# Altium project CC3501_StabilityController.PrjPcb
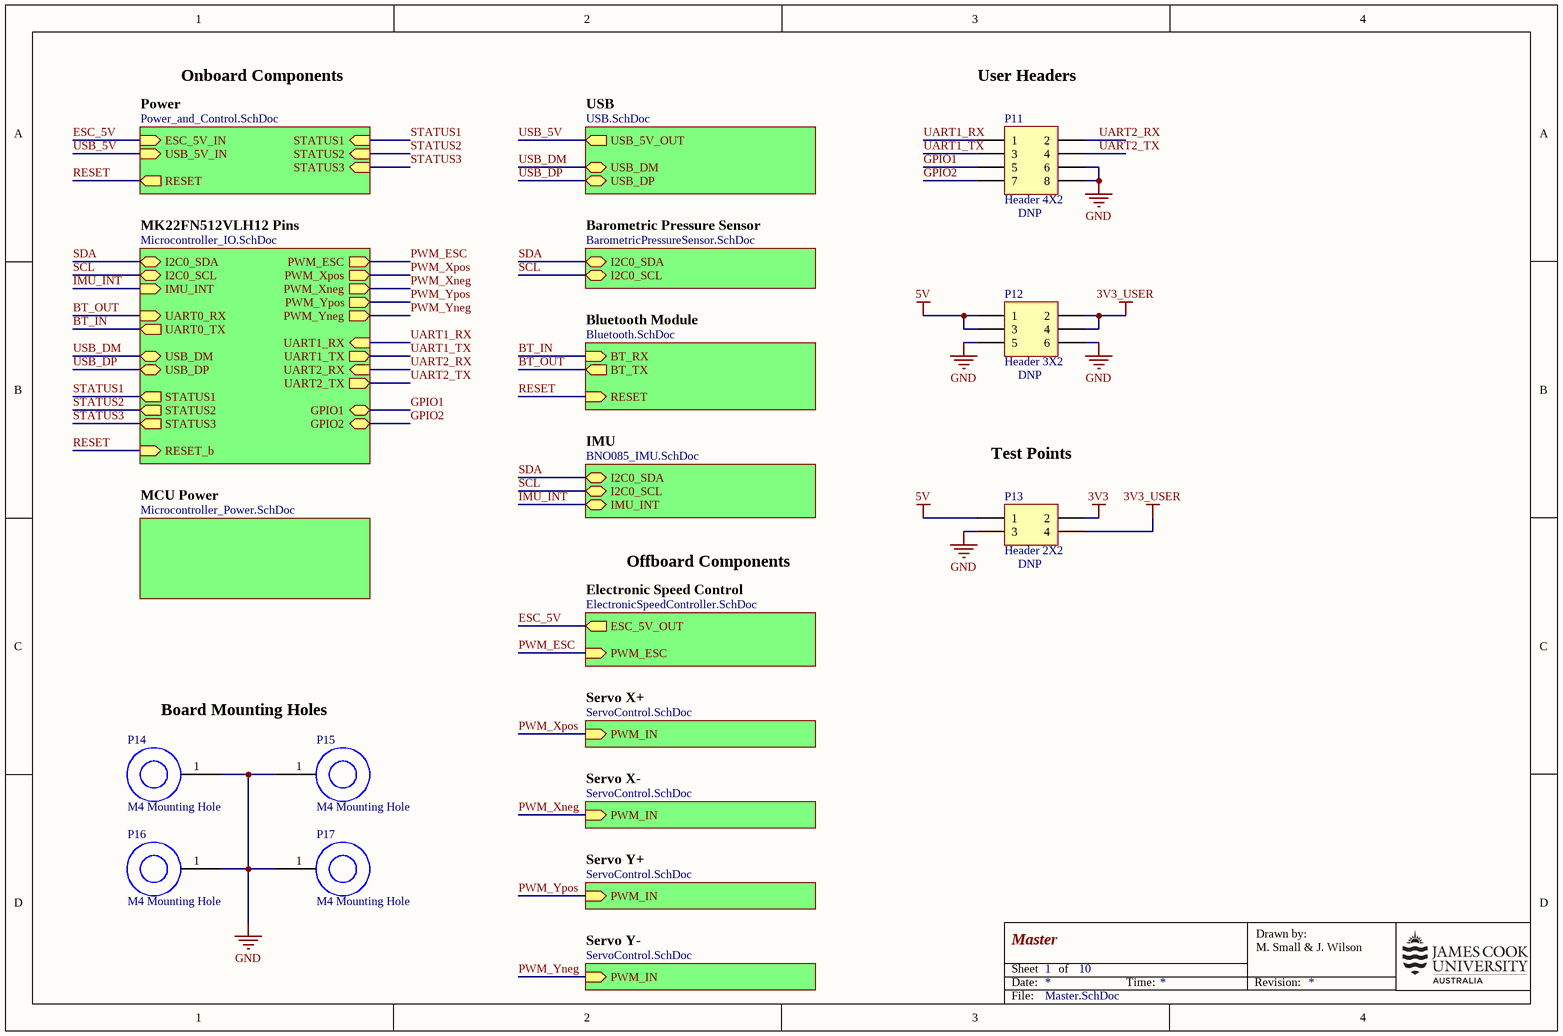
[diagram p0: Master.SchDoc]
10 sheets, 90 parts. Net scope: hierarchical (ports join the sheet entries above them; power ports are global).
Board file: CC3501_StabilityController.PcbDoc
Sheets:
  Master.SchDoc
    MK22FN512VLH12 Pins = Microcontroller_IO.SchDoc
    Power = Power_and_Control.SchDoc
    USB = USB.SchDoc
    Barometric Pressure Sensor = BarometricPressureSensor.SchDoc
    Bluetooth Module = Bluetooth.SchDoc
    IMU = BNO085_IMU.SchDoc
    Electronic Speed Control = ElectronicSpeedController.SchDoc
    Servo X+ = ServoControl.SchDoc
    Servo X- = ServoControl.SchDoc
    Servo Y+ = ServoControl.SchDoc
    Servo Y- = ServoControl.SchDoc
    MCU Power = Microcontroller_Power.SchDoc

## Sheet Master.SchDoc: Master
size A4; DrawnBy: M. Small & J. Wilson; SheetNumber: 1; SheetTotal: 10

### Parts
P11  Header 4X2  [HDR2X4]
P12  Header 3X2  [HDR2X3]
P13  Header 2X2  [HDR2X2]
P14  M4 Mounting Hole  [M4 Mounting Hole]
P15  M4 Mounting Hole  [M4 Mounting Hole]
P16  M4 Mounting Hole  [M4 Mounting Hole]
P17  M4 Mounting Hole  [M4 Mounting Hole]

### Sub-sheets
Barometric Pressure Sensor = BarometricPressureSensor.SchDoc: I2C0_SDA (bidir), I2C0_SCL (bidir)
Bluetooth Module = Bluetooth.SchDoc: BT_RX (in), BT_TX (out), RESET (in)
Electronic Speed Control = ElectronicSpeedController.SchDoc: PWM_ESC (in), ESC_5V_OUT (out)
IMU = BNO085_IMU.SchDoc: I2C0_SDA (bidir), I2C0_SCL (bidir), IMU_INT (bidir)
MCU Power = Microcontroller_Power.SchDoc: no entries
MK22FN512VLH12 Pins = Microcontroller_IO.SchDoc: I2C0_SCL (bidir), I2C0_SDA (bidir), UART0_RX (in), UART1_TX (out), UART2_RX (in), UART1_RX (in), UART0_TX (out), UART2_TX (out), USB_DM (bidir), USB_DP (bidir), IMU_INT (in), PWM_ESC (out), PWM_Xpos (out), PWM_Yneg (out), PWM_Ypos (out), PWM_Xneg (out), RESET_b (in), STATUS2 (out), STATUS3 (out), STATUS1 (out), GPIO2 (bidir), GPIO1 (bidir)
Power = Power_and_Control.SchDoc: USB_5V_IN (in), ESC_5V_IN (in), RESET (out), STATUS1 (in), STATUS2 (in), STATUS3 (in)
Servo X+ = ServoControl.SchDoc: PWM_IN (in)
Servo X- = ServoControl.SchDoc: PWM_IN (in)
Servo Y+ = ServoControl.SchDoc: PWM_IN (in)
Servo Y- = ServoControl.SchDoc: PWM_IN (in)
USB = USB.SchDoc: USB_DM (bidir), USB_DP (bidir), USB_5V_OUT (out)

### Nets
3V3: P13.2
3V3_USER: P12.2 P12.4 P13.4
5V: P12.1 P12.3 P13.1
GND: P11.6 P11.8 P12.5 P12.6 P13.3 P14.1 P15.1 P16.1 P17.1  [project net Ground]
BT_IN: sheet MK22FN512VLH12 Pins/UART0_TX, sheet Bluetooth Module/BT_RX
BT_OUT: sheet MK22FN512VLH12 Pins/UART0_RX, sheet Bluetooth Module/BT_TX
ESC_5V: sheet Power/ESC_5V_IN, sheet Electronic Speed Control/ESC_5V_OUT
GPIO1: P11.5 ; sheet MK22FN512VLH12 Pins/GPIO1
GPIO2: P11.7 ; sheet MK22FN512VLH12 Pins/GPIO2
IMU_INT: sheet MK22FN512VLH12 Pins/IMU_INT, sheet IMU/IMU_INT
PWM_ESC: sheet MK22FN512VLH12 Pins/PWM_ESC, sheet Electronic Speed Control/PWM_ESC  [project net ESC]
PWM_Xneg: sheet MK22FN512VLH12 Pins/PWM_Xneg, sheet Servo X-/PWM_IN  [project net PWM_IN]
PWM_Xpos: sheet MK22FN512VLH12 Pins/PWM_Xpos, sheet Servo X+/PWM_IN  [project net PWM_IN]
PWM_Yneg: sheet MK22FN512VLH12 Pins/PWM_Yneg, sheet Servo Y-/PWM_IN  [project net PWM_IN]
PWM_Ypos: sheet MK22FN512VLH12 Pins/PWM_Ypos, sheet Servo Y+/PWM_IN  [project net PWM_IN]
RESET: sheet MK22FN512VLH12 Pins/RESET_b, sheet Power/RESET, sheet Bluetooth Module/RESET
SCL: sheet MK22FN512VLH12 Pins/I2C0_SCL, sheet Barometric Pressure Sensor/I2C0_SCL, sheet IMU/I2C0_SCL
SDA: sheet MK22FN512VLH12 Pins/I2C0_SDA, sheet Barometric Pressure Sensor/I2C0_SDA, sheet IMU/I2C0_SDA
STATUS1: sheet MK22FN512VLH12 Pins/STATUS1, sheet Power/STATUS1  [project net SLED1]
STATUS2: sheet MK22FN512VLH12 Pins/STATUS2, sheet Power/STATUS2  [project net SLED2]
STATUS3: sheet MK22FN512VLH12 Pins/STATUS3, sheet Power/STATUS3  [project net SLED3]
UART1_RX: P11.1 ; sheet MK22FN512VLH12 Pins/UART1_RX  [project net RX1]
UART1_TX: P11.3 ; sheet MK22FN512VLH12 Pins/UART1_TX  [project net TX1]
UART2_RX: P11.2 ; sheet MK22FN512VLH12 Pins/UART2_RX  [project net RX2]
UART2_TX: P11.4 ; sheet MK22FN512VLH12 Pins/UART2_TX  [project net TX2]
USB_5V: sheet Power/USB_5V_IN, sheet USB/USB_5V_OUT  [project net 5V_OUT]
USB_DM: sheet MK22FN512VLH12 Pins/USB_DM, sheet USB/USB_DM  [project net DM]
USB_DP: sheet MK22FN512VLH12 Pins/USB_DP, sheet USB/USB_DP  [project net DP]

### Notes on the sheet
- Onboard Components
- User Headers
- (near P11) DNP
- (near P12) DNP
- Test Points
- Offboard Components
- (near P13) DNP
- Board Mounting Holes
- Labels drawn without touching a wire or pin: \
- Date:
- Sheet
- of
- Time:
- Revision:
- Drawn by:
- File:

### Library data of the parts
P11 = Header 4X2: Header, 4-Pin, Dual row; LatestRevisionDate: 17-Jul-2002; LatestRevisionNote: Re-released for DXP Platform.; Publisher: Altium Limited
P12 = Header 3X2: Header, 3-Pin, Dual row; LatestRevisionDate: 17-Jul-2002; LatestRevisionNote: Re-released for DXP Platform.; Publisher: Altium Limited
P13 = Header 2X2: Header, 2-Pin, Dual row; LatestRevisionDate: 17-Jul-2002; LatestRevisionNote: Re-released for DXP Platform.; Publisher: Altium Limited
P14-P17 = M4 Mounting Hole: M4 Mounting Hole, ID 3.62mm

## Sheet Microcontroller_IO.SchDoc: Microcontroller IO Ports
size A4; DrawnBy: J. Wilson & M. Small; Revision: 1.0; SheetNumber: 2; SheetTotal: 10
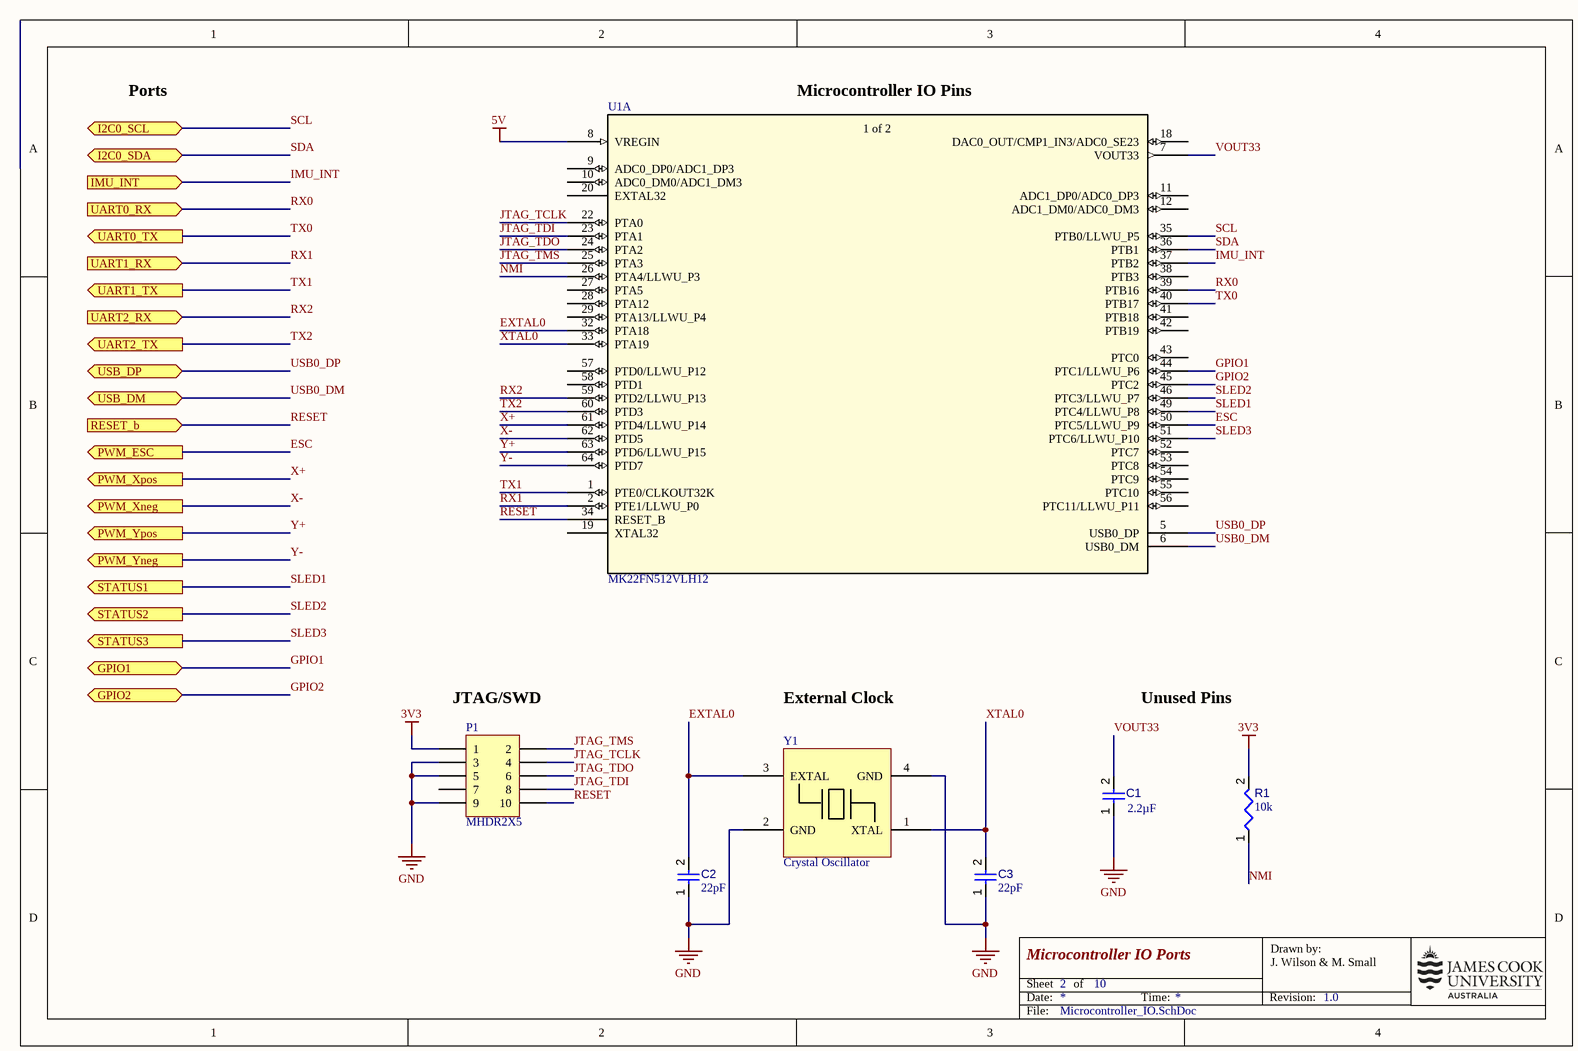
[diagram p1: Microcontroller_IO.SchDoc]

### Parts
C1  value 2.2µF  [CAPC0805(2012)145_L]  (hidden comment: Capacitor 2.2µF +/-20% 10V 0805)
C2  value 22pF  [CAPC0805(2012)145_L]  (hidden comment: Capacitor 22pF +/-5% 0805)
C3  value 22pF  [CAPC0805(2012)145_L]  (hidden comment: Capacitor 22pF +/-5% 0805)
P1  MHDR2X5  [JTAG 2x5 1.27mm]
R1  value 10k  [RESC0805(2012)_L]  (hidden comment: Resistor 10K +/-5% 0805 125 mW)
U1  MK22FN512VLH12  [LQFP-64_10X10X1.6_NXP]  (part A of 2)
Y1  Crystal Oscillator  [ABM3B]

### Ports
GPIO1 (bidir), GPIO2 (bidir), I2C0_SCL (bidir), I2C0_SDA (bidir), IMU_INT (in), PWM_ESC (out), PWM_Xneg (out), PWM_Xpos (out), PWM_Yneg (out), PWM_Ypos (out), RESET_b (in), STATUS1 (out), STATUS2 (out), STATUS3 (out), UART0_RX (in), UART0_TX (out), UART1_RX (in), UART1_TX (out), UART2_RX (in), UART2_TX (out), USB_DM (bidir), USB_DP (bidir)

### Nets
3V3: P1.1 R1.2
5V: U1.8(VREGIN)
GND: C1.1 C2.1 C3.1 P1.3 P1.5 P1.9 Y1.2(GND) Y1.4(GND)  [project net Ground]
ESC: U1.50(PTC5/LLWU_P9) ; port PWM_ESC
EXTAL0: C2.2 U1.32(PTA18) Y1.3(EXTAL)
GPIO1: U1.44(PTC1/LLWU_P6) ; port GPIO1
GPIO2: U1.45(PTC2) ; port GPIO2
IMU_INT: U1.37(PTB2) ; port IMU_INT
JTAG_TCLK: P1.4 U1.22(PTA0)
JTAG_TDI: P1.8 U1.23(PTA1)
JTAG_TDO: P1.6 U1.24(PTA2)
JTAG_TMS: P1.2 U1.25(PTA3)
NMI: R1.1 U1.26(PTA4/LLWU_P3)
RESET: P1.10 U1.34(RESET_B) ; port RESET_b
RX0: U1.39(PTB16) ; port UART0_RX  [project net BT_OUT]
RX1: U1.2(PTE1/LLWU_P0) ; port UART1_RX
RX2: U1.59(PTD2/LLWU_P13) ; port UART2_RX
SCL: U1.35(PTB0/LLWU_P5) ; port I2C0_SCL
SDA: U1.36(PTB1) ; port I2C0_SDA
SLED1: U1.49(PTC4/LLWU_P8) ; port STATUS1
SLED2: U1.46(PTC3/LLWU_P7) ; port STATUS2
SLED3: U1.51(PTC6/LLWU_P10) ; port STATUS3
TX0: U1.40(PTB17) ; port UART0_TX  [project net BT_IN]
TX1: U1.1(PTE0/CLKOUT32K) ; port UART1_TX
TX2: U1.60(PTD3) ; port UART2_TX
USB0_DM: U1.6(USB0_DM) ; port USB_DM  [project net DM]
USB0_DP: U1.5(USB0_DP) ; port USB_DP  [project net DP]
VOUT33: C1.2 U1.7(VOUT33)
X+: U1.61(PTD4/LLWU_P14) ; port PWM_Xpos  [project net PWM_IN]
X-: U1.62(PTD5) ; port PWM_Xneg  [project net PWM_IN]
XTAL0: C3.2 U1.33(PTA19) Y1.1(XTAL)
Y+: U1.63(PTD6/LLWU_P15) ; port PWM_Ypos  [project net PWM_IN]
Y-: U1.64(PTD7) ; port PWM_Yneg  [project net PWM_IN]

Not connected (* = marked no-connect by the designer): P1 7; U1 9(ADC0_DP0/ADC1_DP3) 10(ADC0_DM0/ADC1_DM3) 11(ADC1_DP0/ADC0_DP3) 12(ADC1_DM0/ADC0_DM3) 18(DAC0_OUT/CMP1_IN3/ADC0_SE23) 19(XTAL32) 20(EXTAL32) 27(PTA5) 28(PTA12) 29(PTA13/LLWU_P4) 38(PTB3) 41(PTB18) 42(PTB19) 43(PTC0) 52(PTC7) 53(PTC8) 54(PTC9) 55(PTC10) 56(PTC11/LLWU_P11) 57(PTD0/LLWU_P12) 58(PTD1)

### Notes on the sheet
- Ports
- (near U1) Microcontroller IO Pins
- (near P1) JTAG/SWD
- External Clock
- Unused Pins
- Date:
- Sheet
- of
- Time:
- Revision:
- Drawn by:
- File:
- (in symbol MK22FN512VLH12, part A) 1 of 2

### Library data of the parts
C1 = CMP-001-00079-2: Chip Capacitor, 2.2µF +/-20%, 10V, 0805, Thickness 1.45 mm; Tolerance: 10%; Pins: 2; Max Operating Temperature: 85°C; Mounting Technology: SMT; Case/Package: 0805; Voltage Rating: 10V; Min Operating Temperature: -55°C
C2 C3 = CMP-001-00081-2: Chip Capacitor, 22pF +/- 5%, 0805, Thickness 1.45 mm; Voltage Rating: 16V; Min Operating Temperature: -55°C; Tolerance: 5%; Mounting Technology: SMT; Case/Package: 0402; Pins: 2; Max Operating Temperature: 85°C
P1 = MHDR2X5: Header, 5-Pin, Dual row; LatestRevisionDate: 17-Jul-2002; LatestRevisionNote: Re-released for DXP Platform.; Publisher: Altium Limited
R1 = CMP-009-00118-2: Chip Resistor, 10 kOhms, +/-5%, 125 mW, -55 to 155 degC, 0805; Power: 125mW; Tolerance: 5%; Max Operating Temperature: 155°C; Min Operating Temperature: -55°C; Pins: 2; Case/Package: 0805
U1 = MK22FN512VLH12: No Description Available; SourceLibrary: NXP_2015-03-30; Pin_Count: 64; SRAM_KB: 128; Flash_KB: 512; Max_Frequency: 120; CPU: ARM Cortex-M4F; Vendor: NXP; Copyright: Copyright (C) 2016 Accelerated Designs. All rights reserved; Package: LQFP; Manufacturer_Part_Number: MK22FN512VLH12; RefDes: RefDes; Type: DEV
Y1 = Crystal Oscillator: Abracon  ABM3B Oscillator

## Sheet Power_and_Control.SchDoc: Power & Control
size A4; DrawnBy: M. Small & J. Wilson; SheetNumber: 4; SheetTotal: 10
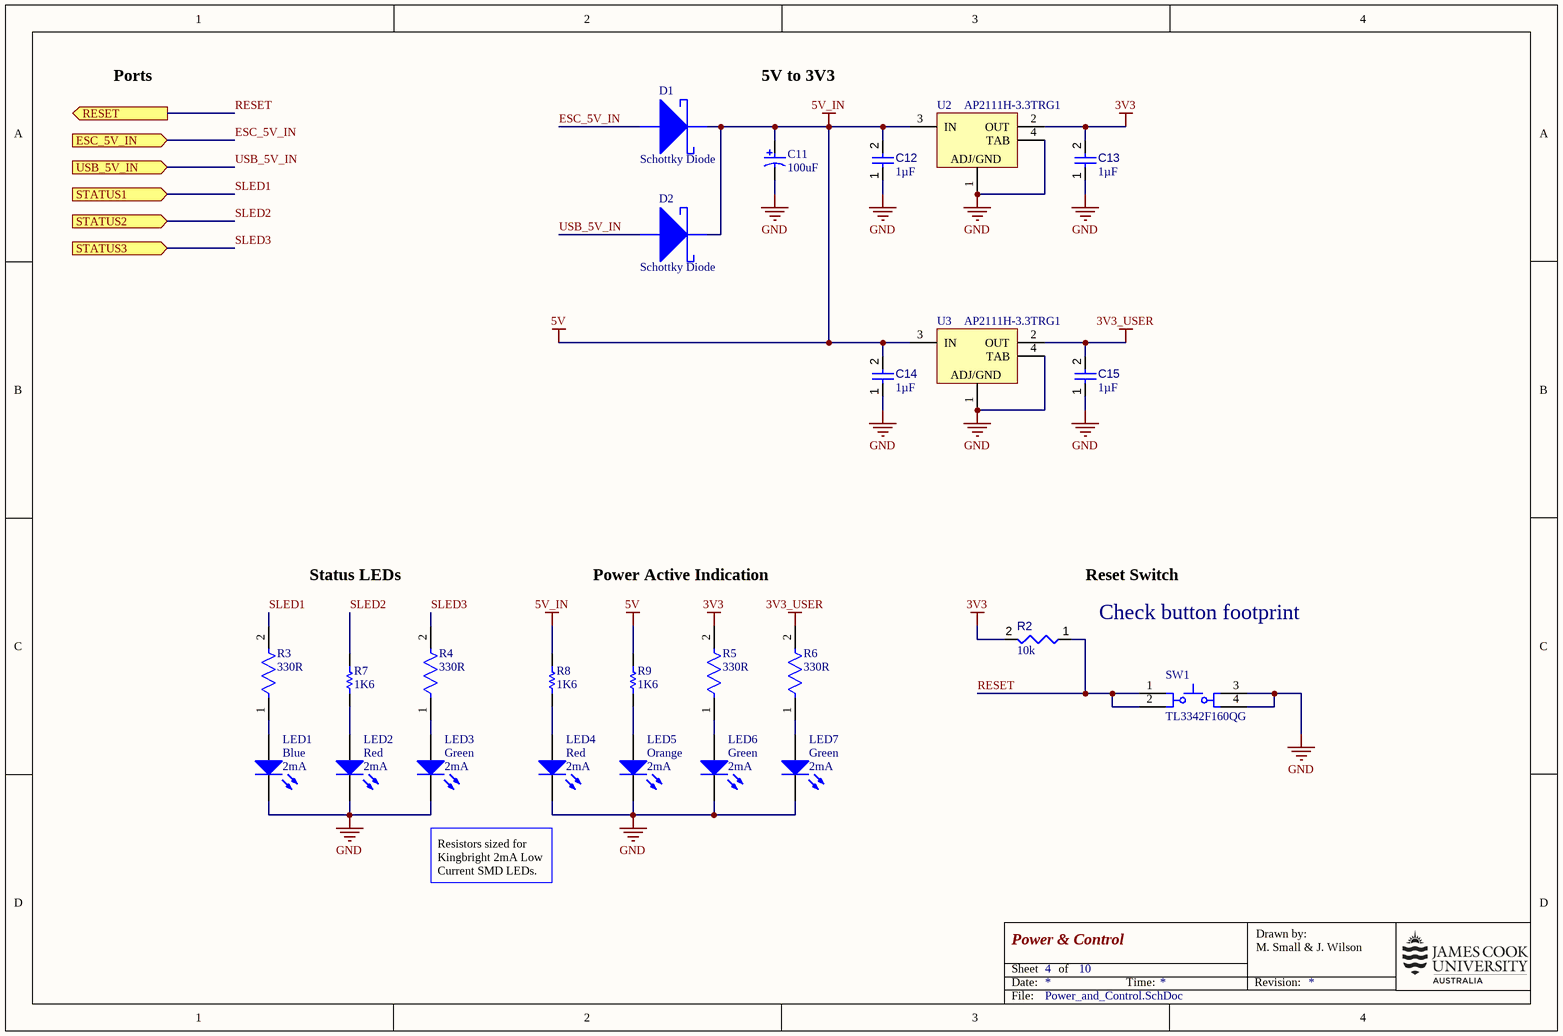
[diagram p2: Power_and_Control.SchDoc]

### Parts
C11  100uF  [PNSC-FP-V-D8_V]
C12  value 1µF  [CAPC0805(2012)145_L]  (hidden comment: Capacitor 1µF +/-20% 25V 0805)
C13  value 1µF  [CAPC0805(2012)145_L]  (hidden comment: Capacitor 1µF +/-20% 25V 0805)
C14  value 1µF  [CAPC0805(2012)145_L]  (hidden comment: Capacitor 1µF +/-20% 25V 0805)
C15  value 1µF  [CAPC0805(2012)145_L]  (hidden comment: Capacitor 1µF +/-20% 25V 0805)
D1  Schottky Diode  [DO-221BC]
D2  Schottky Diode  [DO-221BC]
LED1  Blue  IF: 2mA  [1206_A]
LED2  Red  IF: 2mA  [1206_A]
LED3  Green  IF: 2mA  [1206_A]
LED4  Red  IF: 2mA  [1206_A]
LED5  Orange  IF: 2mA  [1206_A]
LED6  Green  IF: 2mA  [1206_A]
LED7  Green  IF: 2mA  [1206_A]
R2  value 10k  [RESC0805(2012)_L]  (hidden comment: Resistor 10K +/-5% 0805 125 mW)
R3  330R  [FP-CRCW0805-e3-MFG]
R4  330R  [FP-CRCW0805-e3-MFG]
R5  330R  [FP-CRCW0805-e3-MFG]
R6  330R  [FP-CRCW0805-e3-MFG]
R7  1K6  [RESC2013X50X30LL20T20]
R8  1K6  [RESC2013X50X30LL20T20]
R9  1K6  [RESC2013X50X30LL20T20]
SW1  TL3342F160QG  [ESWI-TL3342F160QG_V]
U2  AP2111H-3.3TRG1  [ONSC-SOT-223-4-318H-01_A_V]
U3  AP2111H-3.3TRG1  [ONSC-SOT-223-4-318H-01_A_V]

### Ports
ESC_5V_IN (in), RESET (out), STATUS1 (in), STATUS2 (in), STATUS3 (in), USB_5V_IN (in)

### Nets
3V3: C13.2 R2.2 R5.2 U2.2(OUT)
3V3_USER: C15.2 R6.2 U3.2(OUT)
5V: C11.1 C12.2 C14.2 D1.1 D2.1 R8.2 R9.2 U2.3(IN) U3.3(IN)  [also labelled 5V_IN]
GND: C11.2 C12.1 C13.1 C14.1 C15.1 LED1.1(K) LED2.1(K) LED3.1(K) LED4.1(K) LED5.1(K) LED6.1(K) LED7.1(K) SW1.3 SW1.4 U2.1(ADJ/GND) U2.4(TAB) U3.1(ADJ/GND) U3.4(TAB)  [project net Ground]
ESC_5V_IN: D1.2 ; port ESC_5V_IN  [project net ESC_5V]
RESET: R2.1 SW1.1 SW1.2 ; port RESET
SLED1: R3.2 ; port STATUS1
SLED2: R7.2 ; port STATUS2
SLED3: R4.2 ; port STATUS3
USB_5V_IN: D2.2 ; port USB_5V_IN  [project net 5V_OUT]
NetLED1_2: LED1.2(A) R3.1
NetLED2_2: LED2.2(A) R7.1
NetLED3_2: LED3.2(A) R4.1
NetLED4_2: LED4.2(A) R8.1
NetLED5_2: LED5.2(A) R9.1
NetLED6_2: LED6.2(A) R5.1
NetLED7_2: LED7.2(A) R6.1

### Notes on the sheet
- Ports
- 5V to 3V3
- Status LEDs
- Power Active Indication
- Reset Switch
- Check button footprint
- Resistors sized for Kingbright 2mA Low Current SMD LEDs.
- Date:
- Sheet
- of
- Time:
- Revision:
- Drawn by:
- File:

### Library data of the parts
C11 = CMP-2000-06217-1: Aluminum Electrolytic Capacitor, 100 uF, +/- 20%, 25 V, 2-Pin SMD (Size Code D8), -55 to 105 degC, RoHS, Tape and Reel; Manufacturer: Panasonic; Capacitance: 100µF; Product Range: PANASONIC-FPSeries; SVHC: ToBeAdvised; Ripple Current AC: 600mA; Voltage Rating: 25V; ESR: 0.16ohm; Lifetime @ Temperature: 2000hours@105°C; External Length / Height: 7.7mm; Leakage Current: 25µA; Capacitor Case Style: RadialCan-SMD; Capacitance Tolerance ±: ±20%; Mounting Technology: SurfaceMount; Series: FP; Packaging: CutTape; Operating Temperature Max: 105°C; Height: 7.7mm; Manufacturer URL: http://www.panasonic.com/; Datasheet Version: 03/2016; Capacitance Tolerance: ±20%; Package Reference: PNSC-FP-V-D8; Operating Temperature Range: -55°Cto+105°C; Operating Temperature Min: -55°C; Package Description: 2-Pin Electrolytic Aluminum Capacitor, Body 6.6 x 6.6 mm; Datasheet URL: http://industrial.panasonic.com/cdbs/www-data/pdf/RDE0000/ABA0000C1184.pdf; Package URL: http://industrial.panasonic.com/cdbs/www-data/pdf/RDE0000/DME0000COL48.pdf; Diameter: 6.3mm; Life Time @ Temperature: 2000hours@105°C; AE Capacitor Case: RadialCan-SMD
C12-C15 = CMP-001-00079-2: Chip Capacitor, 1µF +/-20%, 25V, 0805, Thickness 1.45 mm; Tolerance: 10%; Pins: 2; Max Operating Temperature: 85°C; Mounting Technology: SMT; Case/Package: 0805; Voltage Rating: 25V; Min Operating Temperature: -55°C
D1 D2 = Schottky 2 pin 8A: Small Signal Schottky Diode, Single, 45 V, 8 A, 570 mV; Manufacturer P/N: V8PAL45-M3/I; Supplier 1: Element14; Supplier Part Number 1: 2425092; DatasheetURL: http://www.farnell.com/datasheets/2049270.pdf
LED1 = CMP-1426-00015-1: KPT-3216LVVBC-D -  LED, 3.2mm x 1.6mm, Blue, SMD, 2 mA, 2.65 V, 470 nm; Manufacturer: Kingbright; ComponentLink2Description: Datasheet; PartNumber: KPT-3216LVVBC-D; ComponentLink1Description: Manufacturer URL; ComponentLink2URL: http://www.farnell.com/datasheets/2068439.pdf; PackageReference: 1206_A; Color: Blue; Element14 Order Code: 2610425
LED2 LED4 = CMP-1426-00013-1: KPT-3216LVSECK-J3-PRV -  LED, 3.2mm x 1.6mm, Red, SMD, 2 mA, 1.8 V, 625 nm; Manufacturer: Kingbright; ComponentLink2URL: http://www.farnell.com/datasheets/2068435.pdf; ComponentLink2Description: Datasheet; ComponentLink1Description: Manufacturer URL; PartNumber: KPT-3216LVSECK-J3-PRV; PackageReference: 1206_A; Element14 Order Code: 2610421
LED3 LED6 LED7 = CMP-1426-00014-1: KPT-3216LVZGCK -  LED, 3.2mm x 1.6mm, Green, SMD, 2 mA, 2.65 V, 525 nm; Manufacturer: Kingbright; PackageReference: 1206_A; PartNumber: KPT-3216LVZGCK; ComponentLink1Description: Manufacturer URL; ComponentLink2URL: http://www.farnell.com/datasheets/2068438.pdf; ComponentLink2Description: Datasheet; Color: Green; Element14 Order Code: 2610424
LED5 = CMP-1426-00019-1: APT3216LSECK/J4-PRV -  LED, 3.2mm x 1.6mm, Orange, SMD, 2 mA, 1.8 V, 590 nm; PartNumber: KPT-3216LVSYCK-J3-PRV; Manufacturer: Kingbright; Color: Yellow; ComponentLink2URL: http://www.farnell.com/datasheets/2068437.pdf; ComponentLink1Description: Manufacturer URL; PackageReference: 1206_A; ComponentLink2Description: Datasheet; Element14 Order Code: 2610423
R2 = CMP-009-00118-2: as R1 on sheet Microcontroller_IO; Max Operating Temperature: 155°C; Min Operating Temperature: -55°C; Pins: 2; Case/Package: 0805
R3-R6 = CMP-2001-03823-2: RES Thick Film, 330Ω, 1%, 0.125W, 100ppm/°C, 0805; Voltage Rating (DC): 150V; Max Power Dissipation: 125mW; Mount: Surface Mount; Packaging: Tape and Reel; Min Operating Temperature: -55°C; Resistance: 330R; Military Standard: Not; Case Code (Metric): 2012; Height: 0.02inch; Voltage Rating: 150V; Case/Package: 0805; Max Operating Temperature: 155°C; Width: 0.049inch; Case Code (Imperial): 0805; Termination: SMD/SMT; Lead Free: Lead Free; Contact Plating: Tin; Package Quantity: 10; Composition: Thick Film; Length: 2mm; Features: Automotive AEC-Q200; Depth: 1.25mm; Weight: 0.000194oz; Tolerance: 1%; Power Rating: 125mW; Number of Terminations: 2; Temperature Coefficient: 100ppm/°C
R7-R9 = CMP-1013-00531-2: Part Number: CRCW08051K60FKEA; Manufacturer: Vishay Dale
SW1 = CMP-011-00008-1: Tactile Switch, SPST-NO, 50 mA, 12 V, 4-Pin SMD, RoHS, Tape and Reel; Manufacturer: E-Switch; Operating Force: 1.6N; Throw Configuration: SPST; Max Voltage Rating (DC): 12V; Current Rating: 50mA; Datasheet URL: http://spec_sheets.e-switch.com/specs/P010632.pdf; Mounting Technology: SM; Manufacturer URL: http://www.e-switch.ch/en/; Contact Plating: Silver; Datasheet Version: Rev. I, 12/2010; Package Quantity: 3000; Package Reference: TL3342F160QG; RoHS Compliant: True; Package Description: 4-Pin Surface Mount Device, Body 5 x 5 mm, Pitch 6.3 mm; Case/Package: TL3342F160QG; Packaging: TapeandReel; Voltage Rating (DC): 12V; Contact Material: Silver
U2 U3 = CMP-019-00030-2: Low-Dropout Positive Fixed Voltage Regulator, 1 A, 3.3 V Output Voltage, 0 to 125 degC, 4-Pin SOT-223 (318H-01), Pb-Free, Tape and Reel; Manufacturer: ON Semiconductor; Nominal Output Voltage: 3.3V; Min Supply Voltage: 4.75V; Outputs: 1; Max Ouput Current: 1A; Dropout Voltage: 1.1V; Max Supply Voltage: 15V; Max Input Voltage: 20V; Min Input Voltage: 3.5V; Package Description: 4-Pin Small Outline Transistor, Body 6.5 x 3.5 mm, Pitch 2.3 mm; Datasheet Version: Rev. 27, 09/2014; Package Quantity: 4000; Mounting Technology: SM; Datasheet URL: http://www.onsemi.com/pub_link/Collateral/NCP1117-D.PDF; Output Voltage: 3.3V; Manufacturer URL: http://www.onsemi.com/; Output Current: 1A; Min Operating Temperature: 0°C; Package Reference: SOT-223-4-318H-01_A; Max Operating Temperature: 125°C; Pins: 3; Packaging: TapeandReel; Case/Package: SOT-223-4; RoHS Compliant: True

## Sheet USB.SchDoc: USB Connection
size A4; DrawnBy: M. Small & J. Wilson; SheetNumber: 10; SheetTotal: 10
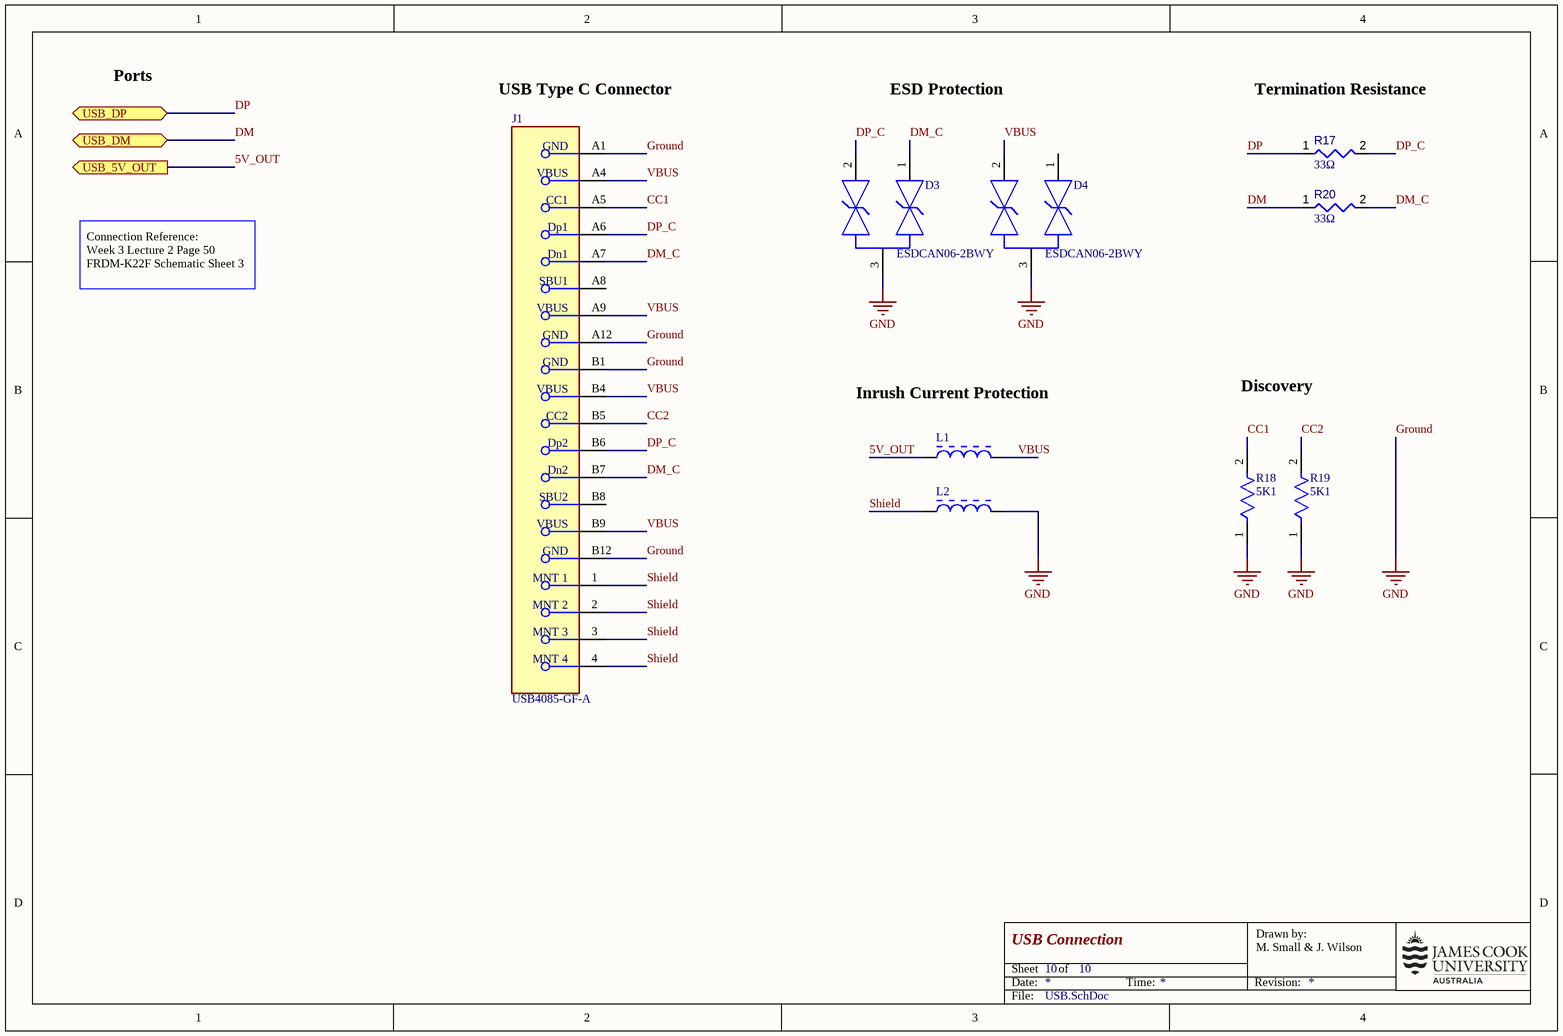
[diagram p3: USB.SchDoc]

### Parts
D3  ESDCAN06-2BWY  [FP-SOT323-3L-MFG]
D4  ESDCAN06-2BWY  [FP-SOT323-3L-MFG]
J1  USB4085-GF-A  [FP-USB4085-GF-A-MFG]
L1  Z0805C331BPWZT  [INDC2013X105X50ML20T20]  (value not drawn)
L2  Z0805C331BPWZT  [INDC2013X105X50ML20T20]  (value not drawn)
R17  value 33Ω  [RESC0805(2012)_L]
R18  5K1  [FP-CRCW0805-e3-MFG]
R19  5K1  [FP-CRCW0805-e3-MFG]
R20  value 33Ω  [RESC0805(2012)_L]

### Ports
USB_5V_OUT (out), USB_DM (bidir), USB_DP (bidir)

### Nets
Ground: D3.3 D4.3 J1.A1(GND) J1.A12(GND) J1.B1(GND) J1.B12(GND) L2.2 R18.1 R19.1  [also labelled GND]
5V_OUT: L1.1 ; port USB_5V_OUT
CC1: J1.A5(CC1) R18.2
CC2: J1.B5(CC2) R19.2
DM: R20.1 ; port USB_DM
DM_C: D3.1 J1.A7(Dn1) J1.B7(Dn2) R20.2
DP: R17.1 ; port USB_DP
DP_C: D3.2 J1.A6(Dp1) J1.B6(Dp2) R17.2
Shield: J1.1(MNT_1) J1.2(MNT_2) J1.3(MNT_3) J1.4(MNT_4) L2.1
VBUS: D4.2 J1.A4(VBUS) J1.A9(VBUS) J1.B4(VBUS) J1.B9(VBUS) L1.2

Not connected (* = marked no-connect by the designer): D4 1; J1 A8(SBU1) B8(SBU2)

### Notes on the sheet
- Ports
- USB Type C Connector
- ESD Protection
- Termination Resistance
- Connection Reference:
  Week 3 Lecture 2 Page 50
  FRDM-K22F Schematic Sheet 3
- Inrush Current Protection
- Discovery
- Date:
- Sheet
- of
- Time:
- Revision:
- Drawn by:
- File:

### Library data of the parts
D3 D4 = CMP-12225-000055-1: TVS DIODE 35V 59V SOT323-3; Manufacturer: STMicroelectronics; Manufacturer Part Number: ESDCAN02-2BWY; Value: 15pF; Direction: Bidirectional; Breakdown Voltage: 38V; Automotive Grade: Grade 0; Standoff Height: 0mm; Peak Pulse Power: 170W; Peak Pulse Current: 3A; Capacitance: 3pF; Number Of Channels: 2; Max Junction Temp: +175°C; Mouser Description: TVS Diodes / ESD Suppressors Automotive dual-line Transil, Transient voltage suppressor (TVS) for CAN bus; Height: 1.1mm; Category: Diode; Reverse Standoff Voltage: 35V; Device Class L1: Circuit Protection; Temperature: -55°C to +175°C; RoHS: TRUE; ComponentLink2URL: https://www.st.com/resource/en/datasheet/esdcan02-2bwy.pdf; Device Class L3: unset; Device Class L2: TVS Diodes; Temperature Range High: +175°C; Octopart: https://octopart.com/esdcan02-2bwy-stmicroelectronics-58631133; Ipc Land Pattern Name: SOT65P210X95-3; Temperature Range Low: -55°C; Digikey Description: TVS DIODE 26.5V 44V SOT323-3; Automotive: Yes; ComponentLink2Description: Datasheet; Clamping Voltage: 59V; Lead Free: Yes; Package: SOT323-3L; Datasheet: https://au.mouser.com/datasheet/2/389/dm00551472-1799515.pdf
J1 = CMP-196119-000001-1: CONN RCPT USB2.0 TYPEC 16POS; Manufacturer: Global Connector Technology; Voltage Rating: 20V; Conn Orientation: Right Angle; Shielding: true; Current Rating: 4.25A; Number Of Contacts: 16; Pitch: 0.85mm; Is Female: yes; ComponentLink2URL: https://gct.co/files/drawings/usb4085.pdf; Category: Conn; Automotive: No; ComponentLink2Description: Datasheet; Height: 3.66mm; Manufacturer Part Number: USB4085-GF-A; Package: 0; Usb Standard: USB 2.0; Octopart: https://octopart.com/usb4085-gf-a-global+connector+technology-94773699; Device Class L3: unset; Digikey Description: CONN RCPT USB2.0 TYPEC 16POS; Temperature Range Low: -40°C; Temperature: -40°C to +85°C; Lead Free: Yes; Contact Material: Gold,Nickel; Device Class L1: Connectors; Temperature Range High: +85°C; Device Class L2: USB Connectors; RoHS: TRUE
L1 L2 = CMP-006-00000-2: IND, Chip Ferrite Bead, 330 Ohm, +/- 25%, 1.8 A, -40 to 125 degC, 0805 (2012 Metric), Tape and Reel; Manufacturer: KEMET; Max Current Rating: 1.8A; Resistance: 90mohm; Impedance: 330Ohm; Package Reference: 0805; Tolerance: 25%; Current Rating: 1.8A; Mounting Technology: SM; Min Operating Temperature: -40°C; Max Operating Temperature: 125°C; Core Material: Ferrite; Package Description: 2-Pin Surface Mount Device, Body 2 x1.25 mm; RoHS Compliant: True; Packaging: TapeandReel; Package Quantity: 4000; Datasheet Version: Nov-11; Datasheet URL: https://au.mouser.com/datasheet/2/212/1/KEM_FB0002_Z_PWZ-2064396.pdf; Case/Package: 0805
R17 R20 = CMP-009-00106-1: 33R 0.125W 5% 0805 (2012 Metric)  SMD; Tolerance: 5%; Power: 0.125W; Mounting Technology: SMT; Case/Package: 0805; Pins: 2
R18 R19 = CMP-2001-03823-2: RES Thick Film, 5K1Ω, 1%, 0.125W, 100ppm/°C, 0805; Voltage Rating (DC): 150V; Max Power Dissipation: 125mW; Mount: Surface Mount; Packaging: Tape and Reel; Min Operating Temperature: -55°C; Resistance: 5K1; Military Standard: Not; Case Code (Metric): 2012; Height: 0.02inch; Voltage Rating: 150V; Case/Package: 0805; Max Operating Temperature: 155°C; Width: 0.049inch; Case Code (Imperial): 0805; Termination: SMD/SMT; Lead Free: Lead Free; Contact Plating: Tin; Package Quantity: 10; Composition: Thick Film; Length: 2mm; Features: Automotive AEC-Q200; Depth: 1.25mm; Weight: 0.000194oz; Tolerance: 1%; Power Rating: 125mW; Number of Terminations: 2; Temperature Coefficient: 100ppm/°C

## Sheet BarometricPressureSensor.SchDoc: Barometric Pressure Sensor
size A4; DrawnBy: M. Small & J. Wilson; SheetNumber: 5; SheetTotal: 10
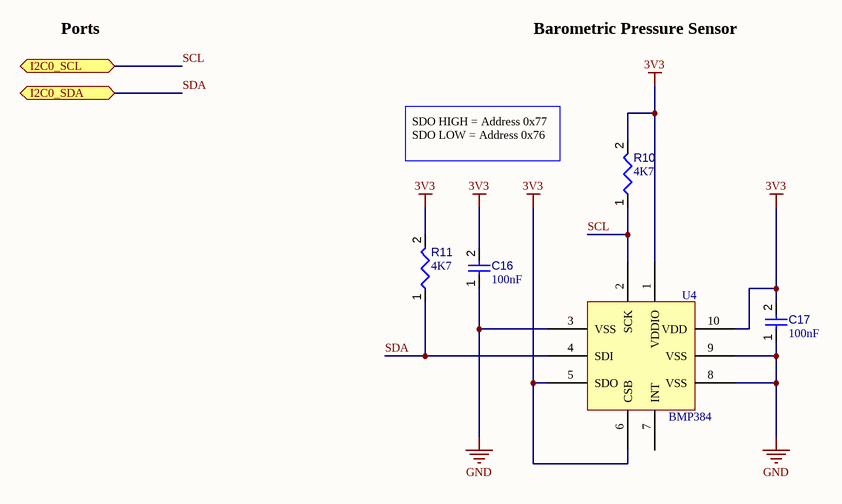
[diagram p4: BarometricPressureSensor.SchDoc]

### Parts
C16  value 100nF  [CAPC0805(2012)145_L]  (hidden comment: Capacitor 100nF +/-20% 25V 0805)
C17  value 100nF  [CAPC0805(2012)145_L]  (hidden comment: Capacitor 100nF +/-20% 25V 0805)
R10  4K7  [RESC0805(2012)_L]
R11  4K7  [RESC0805(2012)_L]
U4  BMP384  [BMP384 LGA 2.0x2.0x0.95mm 10pin]

### Ports
I2C0_SCL (bidir), I2C0_SDA (bidir)

### Nets
3V3: C16.2 C17.2 R10.2 R11.2 U4.1(VDDIO) U4.5(SDO) U4.6(CSB) U4.10(VDD)
GND: C16.1 C17.1 U4.3(VSS) U4.8(VSS) U4.9(VSS)  [project net Ground]
SCL: R10.1 U4.2(SCK) ; port I2C0_SCL
SDA: R11.1 U4.4(SDI) ; port I2C0_SDA

Not connected (* = marked no-connect by the designer): U4 7(INT)

### Notes on the sheet
- Ports
- Barometric Pressure Sensor
- SDO HIGH = Address 0x77 SDO LOW = Address 0x76
- Date:
- Sheet
- of
- Time:
- Revision:
- Drawn by:
- File:

### Library data of the parts
C16 C17 = CMP-001-00079-2: Chip Capacitor, 100nF +/-20%, 25V, 0805, Thickness 1.45 mm; Tolerance: 10%; Pins: 2; Max Operating Temperature: 85°C; Mounting Technology: SMT; Case/Package: 0805; Voltage Rating: 25V; Min Operating Temperature: -55°C
R10 R11 = CMP-009-00076-1: 4K7 0.125W 5% 0805 (2012 Metric)  SMD; Mounting Technology: SMT; Power: 0.125W; Value: 4K7; Pins: 2; Case/Package: 0805; Tolerance: 5%
U4 = BMP384 Barometric Pressure Sensor: Bosch BMP384 Barometric Pressure Sensor

## Sheet Bluetooth.SchDoc: Bluetooth Module
size A4; DrawnBy: M. Small & J. Wilson; SheetNumber: 6; SheetTotal: 10
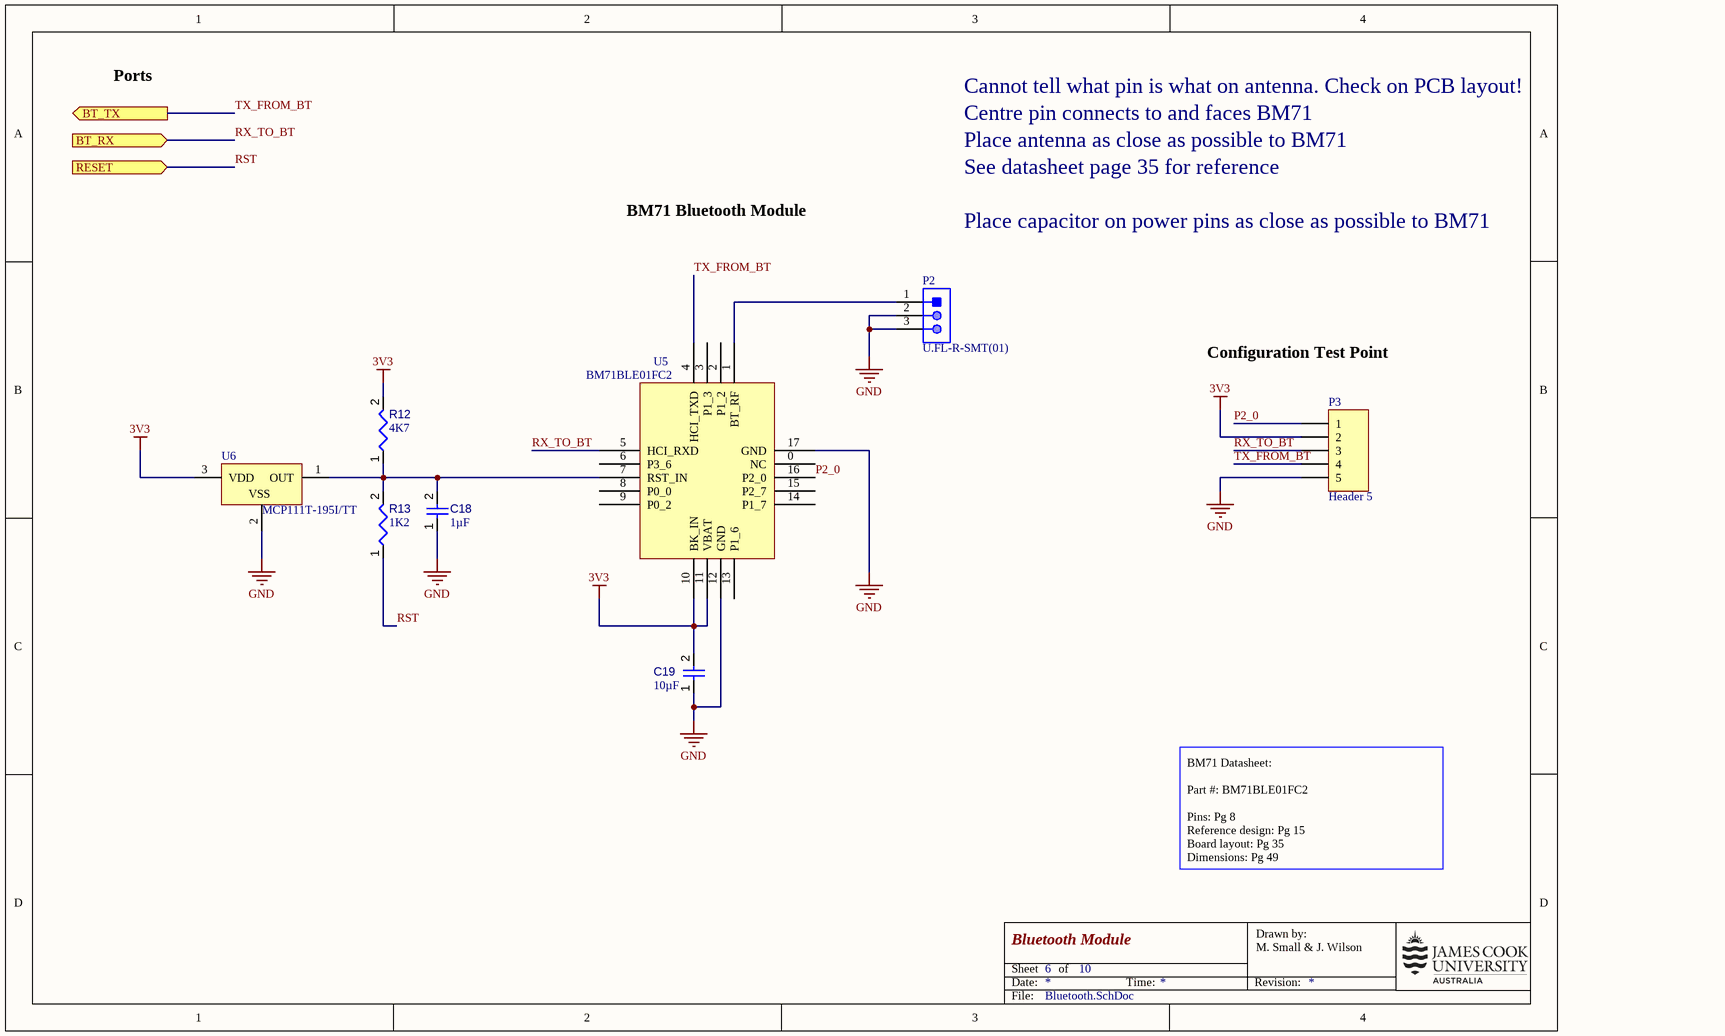
[diagram p5: Bluetooth.SchDoc]

### Parts
C18  value 1µF  [CAPC0805(2012)145_L]  (hidden comment: Capacitor 1µF +/-20% 25V 0805)
C19  value 10µF  [CAPC0805(2012)145_L]  (hidden comment: Capacitor 10µF +/-20% 25V 0805)
P2  U.FL-R-SMT(01)  [HRS-U.FL-R-SMT(10)_V]
P3  Header 5  [HDR1X5]
R12  value 4K7  [RESC0805(2012)_L]  (hidden comment: Resistor 4K7 +/-1% 0805 125 mW)
R13  1K2  [RESC0805(2012)_L]
U5  BM71BLE01FC2  [BM71BLE01FC2]
U6  MCP111T-195I/TT  [SOT-23-TT3_M]

### Ports
BT_RX (in), BT_TX (out), RESET (in)

### Nets
3V3: C19.2 P3.2 R12.2 U5.10(BK_IN) U5.11(VBAT) U6.3(VDD)
GND: C18.1 C19.1 P2.2 P2.3 P3.5 U5.12(GND) U5.17(GND) U6.2(VSS)  [project net Ground]
P2_0: P3.1 U5.16(P2_0)
RST: R13.1 ; port RESET  [project net RESET]
RX_TO_BT: P3.3 U5.5(HCI_RXD) ; port BT_RX  [project net BT_IN]
TX_FROM_BT: P3.4 U5.4(HCI_TXD) ; port BT_TX  [project net BT_OUT]
NetC18_2: C18.2 R12.1 R13.2 U5.7(RST_IN) U6.1(OUT)
NetP2_1: P2.1 U5.1(BT_RF)

Not connected (* = marked no-connect by the designer): U5 0(NC) 2(P1_2) 3(P1_3) 6(P3_6) 8(P0_0) 9(P0_2) 13(P1_6) 14(P1_7) 15(P2_7)

### Notes on the sheet
- Ports
- Cannot tell what pin is what on antenna. Check on PCB layout!
- Place antenna as close as possible to BM71
- See datasheet page 35 for reference
- Centre pin connects to and faces BM71
- BM71 Bluetooth Module
- Place capacitor on power pins as close as possible to BM71
- Configuration Test Point
- BM71 Datasheet:
  Part #: BM71BLE01FC2
  Pins: Pg 8
  Reference design: Pg 15
  Board layout: Pg 35
  Dimensions: Pg 49
  Footprint: Pg 50
- Date:
- Sheet
- of
- Time:
- Revision:
- Drawn by:
- File:

### Library data of the parts
C18 = CMP-001-00079-2: as C12 on sheet Power_and_Control; Pins: 2; Max Operating Temperature: 85°C; Mounting Technology: SMT; Case/Package: 0805; Voltage Rating: 25V; Min Operating Temperature: -55°C
C19 = CMP-001-00079-2: Chip Capacitor, 10µF +/-20%, 25V, 0805, Thickness 1.45 mm; Tolerance: 10%; Pins: 2; Max Operating Temperature: 85°C; Mounting Technology: SMT; Case/Package: 0805; Voltage Rating: 25V; Min Operating Temperature: -55°C
P2 = CMP-2000-05151-1: CONN RECPT ULTRA-MINI COAX SMD; Manufacturer: Hirose Electric; Centre Contact Resistance: 25mohm; Voltage Rating V AC: 60V; Female Contact Material: PhosphorBronze; Contact Resistance: 10mohm; Male Contact Material: Brass; Connector Type: UFLCoaxial; Connector Mounting: PCB; Impedance: 50ohm; Insulation Resistance: 500Mohm; Secondary Insulation Material: PBT; Frequency Max: 6GHz; Body Plating: Silver; External Length / Height: 2.5mm; Approval Category: UL94V-0; Female Contact Plating: Gold; Connector Mounting Orientation: PCBoard; VSWR: 1.3; Coaxial Termination: Solder; Body Style: StraightJack; SVHC: NoSVHC(18-Jun-2012); Jacket Material: LCP; Package Reference: U.FL-R-SMT(10); Datasheet Version: Feb-04; Outer Contact Resistance: 10mohm; Contact Plating: Gold; Mounting Type: PCBoard; Flammability Rating: UL94V-0; Operating Frequency Max: 6GHz; Termination Method: Solder; Male Contact Plating: Gold; Package Description: 3-Pin Surface Mount Device, Body 2.6 x 2.6 mm; Operating Temperature Min: -40degC; Manufacturer URL: https://www.hirose.com; Operating Temperature Max: 90degC; Contact Material: PhosphorBronze; Datasheet URL: http://www.farnell.com/datasheets/91524.pdf; Material: PhosphorBronze
P3 = Header 5: Header, 5-Pin; LatestRevisionDate: 17-Jul-2002; LatestRevisionNote: Re-released for DXP Platform.; Publisher: Altium Limited
R12 = CMP-009-00118-2: Chip Resistor, 4.7kOhms, +/-1%, 125 mW, -55 to 155 degC, 0805; Power: 125mW; Tolerance: 1%; Max Operating Temperature: 155°C; Min Operating Temperature: -55°C; Pins: 2; Case/Package: 0805
R13 = CMP-009-00076-1: 1K2 0.125W 5% 0805 (2012 Metric)  SMD; Mounting Technology: SMT; Power: 0.125W; Value: 1K2; Pins: 2; Case/Package: 0805; Tolerance: 5%
U5 = BM71BLE01FC2: Microchip BM71BLE01FC2 Bluetooth Low Energy (BLE) Module; Datasheet: https://au.mouser.com/datasheet/2/268/Bluetooth_Low_Energy_BLE_Module_DS60001372K-2257931.pdf
U6 = CMP-0130-00051-1: 1.75Î¼A Micropower Voltage Detector, Open-Drain Output, 1.90V, 3-Pin SOT-23, Industrial Temperature, Tape and Reel; PackageDescription: 3-Lead Plastic Small Outline Transistor (TT) [SOT-23]; DatasheetVersion: revD, Jun-2005; PackageVersion: revBB, Aug-2009; Code_IPC: SOT23-3; PackageReference: SOT-23-TT3

## Sheet BNO085_IMU.SchDoc: IMU
size A4; DrawnBy: M. Small & J. Wilson; SheetNumber: 9; SheetTotal: 10
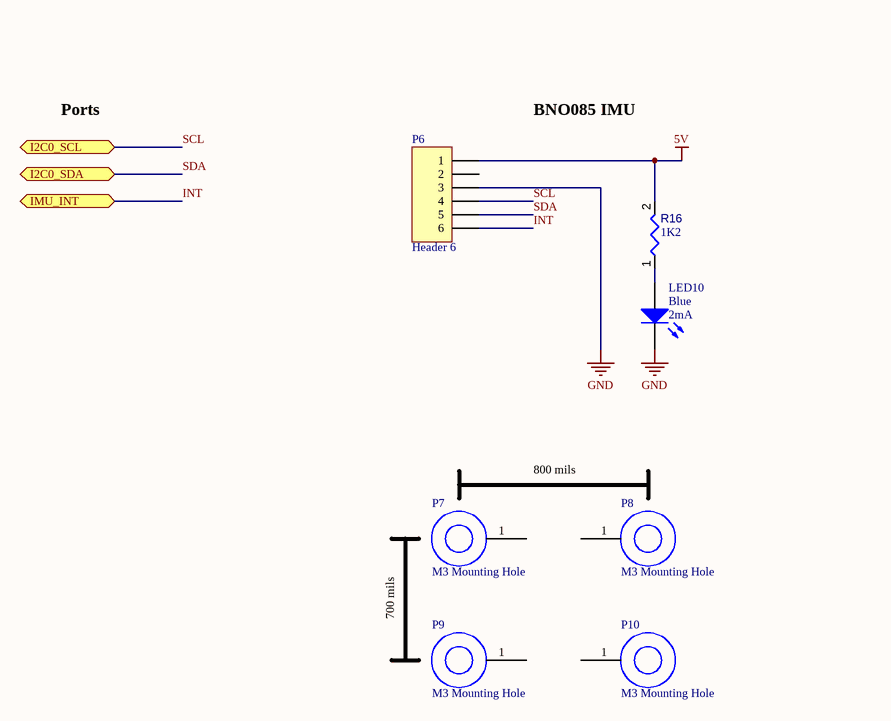
[diagram p6: BNO085_IMU.SchDoc]

### Parts
LED10  Blue  IF: 2mA  [1206_A]
P6  Header 6  [HDR1X6]
P7  M3 Mounting Hole  [M3 Mounting Hole]
P8  M3 Mounting Hole  [M3 Mounting Hole]
P9  M3 Mounting Hole  [M3 Mounting Hole]
P10  M3 Mounting Hole  [M3 Mounting Hole]
R16  1K2  [RESC0805(2012)_L]

### Ports
I2C0_SCL (bidir), I2C0_SDA (bidir), IMU_INT (bidir)

### Nets
5V: P6.1 R16.2
GND: LED10.1(K) P6.3  [project net Ground]
INT: P6.6 ; port IMU_INT  [project net IMU_INT]
SCL: P6.4 ; port I2C0_SCL
SDA: P6.5 ; port I2C0_SDA
NetLED10_2: LED10.2(A) R16.1

Not connected (* = marked no-connect by the designer): P6 2; P7 1; P8 1; P9 1; P10 1

### Notes on the sheet
- Ports
- BNO085 IMU
- 800 mils
- 700 mils
- Date:
- Sheet
- of
- Time:
- Revision:
- Drawn by:
- File:

### Library data of the parts
LED10 = CMP-1426-00015-1: as LED1 on sheet Power_and_Control; ComponentLink2Description: Datasheet; PartNumber: KPT-3216LVVBC-D; ComponentLink1Description: Manufacturer URL; ComponentLink2URL: http://www.farnell.com/datasheets/2068439.pdf; PackageReference: 1206_A; Color: Blue; Element14 Order Code: 2610425
P6 = Header 6: Header, 6-Pin; LatestRevisionDate: 17-Jul-2002; LatestRevisionNote: Re-released for DXP Platform.; Publisher: Altium Limited
P7-P10 = M3 Mounting Hole: M3 Mounting Hole, ID 2.73mm
R16 = CMP-009-00076-1: 1K2 0.125W 5% 0805 (2012 Metric)  SMD; Mounting Technology: SMT; Power: 0.125W; Value: 1K2; Pins: 2; Case/Package: 0805; Tolerance: 5%

## Sheet ElectronicSpeedController.SchDoc: Electronic Speed Controller
size A4; DrawnBy: M. Small & J. Wilson; SheetNumber: 7; SheetTotal: 10
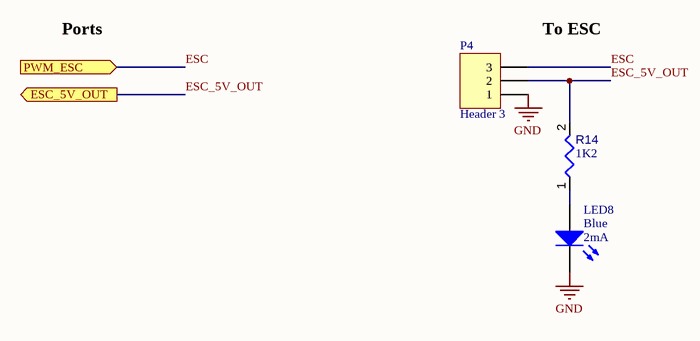
[diagram p7: ElectronicSpeedController.SchDoc]

### Parts
LED8  Blue  IF: 2mA  [1206_A]
P4  Header 3  [HDR1X3]
R14  1K2  [RESC0805(2012)_L]

### Ports
ESC_5V_OUT (out), PWM_ESC (in)

### Nets
GND: LED8.1(K) P4.1  [project net Ground]
ESC: P4.3 ; port PWM_ESC
ESC_5V_OUT: P4.2 R14.2 ; port ESC_5V_OUT  [project net ESC_5V]
NetLED8_2: LED8.2(A) R14.1

### Notes on the sheet
- Ports
- (near P4) To ESC
- Date:
- Sheet
- of
- Time:
- Revision:
- Drawn by:
- File:

### Library data of the parts
LED8 = CMP-1426-00015-1: as LED1 on sheet Power_and_Control; ComponentLink2Description: Datasheet; PartNumber: KPT-3216LVVBC-D; ComponentLink1Description: Manufacturer URL; ComponentLink2URL: http://www.farnell.com/datasheets/2068439.pdf; PackageReference: 1206_A; Color: Blue; Element14 Order Code: 2610425
P4 = Header 3: Header, 3-Pin; LatestRevisionDate: 17-Jul-2002; LatestRevisionNote: Re-released for DXP Platform.; Publisher: Altium Limited
R14 = CMP-009-00076-1: 1K2 0.125W 5% 0805 (2012 Metric)  SMD; Mounting Technology: SMT; Power: 0.125W; Value: 1K2; Pins: 2; Case/Package: 0805; Tolerance: 5%

## Sheet ServoControl.SchDoc: Servo Control
size A4; DrawnBy: M. Small & J. Wilson; SheetNumber: 8; SheetTotal: 10
Used 4 times, as channels Servo X+, Servo X-, Servo Y+, Servo Y-. Parts and nets are listed once, with the designators drawn on the sheet.
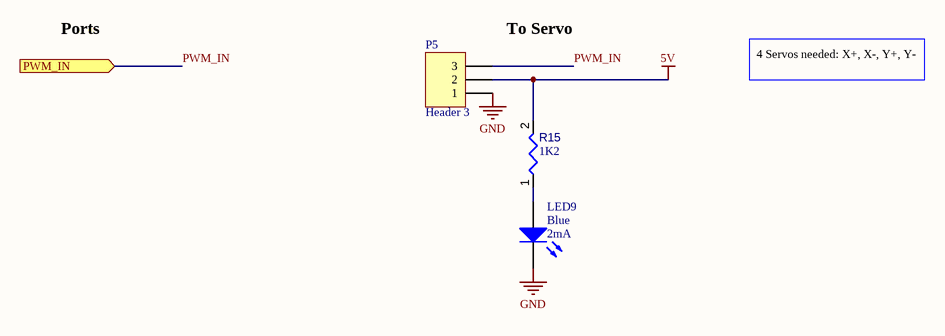
[diagram p8: ServoControl.SchDoc]

### Parts
LED9  Blue  IF: 2mA  [1206_A]
P5  Header 3  [HDR1X3]
R15  1K2  [RESC0805(2012)_L]

### Ports
PWM_IN (in)

### Nets
5V: P5.2 R15.2
GND: LED9.1(K) P5.1
PWM_IN: P5.3 ; port PWM_IN
NetLED9_2: LED9.2(A) R15.1

### Channels
Servo X+: designators end in _Servo_X+; ports PWM_IN=PWM_IN
Servo X-: designators end in _Servo_X-; ports PWM_IN=PWM_IN
Servo Y+: designators end in _Servo_Y+; ports PWM_IN=PWM_IN
Servo Y-: designators end in _Servo_Y-; ports PWM_IN=PWM_IN

### Notes on the sheet
- Ports
- (near P5) To Servo
- 4 Servos needed: X+, X-, Y+, Y-
- Date:
- Sheet
- of
- Time:
- Revision:
- Drawn by:
- File:

### Library data of the parts
LED9 = CMP-1426-00015-1: as LED1 on sheet Power_and_Control; ComponentLink2Description: Datasheet; PartNumber: KPT-3216LVVBC-D; ComponentLink1Description: Manufacturer URL; ComponentLink2URL: http://www.farnell.com/datasheets/2068439.pdf; PackageReference: 1206_A; Color: Blue; Element14 Order Code: 2610425
P5 = Header 3: Header, 3-Pin; LatestRevisionDate: 17-Jul-2002; LatestRevisionNote: Re-released for DXP Platform.; Publisher: Altium Limited
R15 = CMP-009-00076-1: 1K2 0.125W 5% 0805 (2012 Metric)  SMD; Mounting Technology: SMT; Power: 0.125W; Value: 1K2; Pins: 2; Case/Package: 0805; Tolerance: 5%

## Sheet Microcontroller_Power.SchDoc: Microcontroller Power
size A4; DrawnBy: J. Wilson & M. Small; SheetNumber: 3; SheetTotal: 10
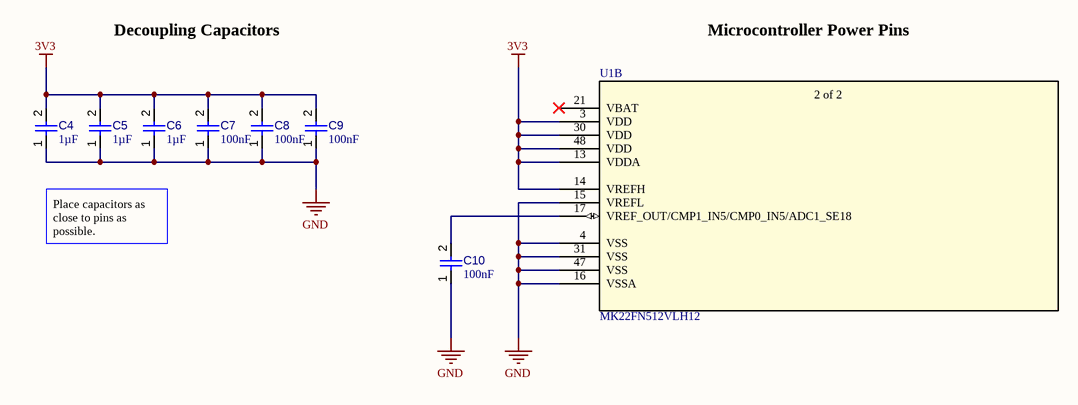
[diagram p9: Microcontroller_Power.SchDoc]

### Parts
C4  value 1µF  [CAPC0805(2012)145_L]  (hidden comment: Capacitor 1µF +/-20% 25V 0805)
C5  value 1µF  [CAPC0805(2012)145_L]  (hidden comment: Capacitor 1µF +/-20% 25V 0805)
C6  value 1µF  [CAPC0805(2012)145_L]  (hidden comment: Capacitor 1µF +/-20% 25V 0805)
C7  value 100nF  [CAPC0805(2012)145_L]  (hidden comment: Capacitor 100nF +/-20% 25V 0805)
C8  value 100nF  [CAPC0805(2012)145_L]  (hidden comment: Capacitor 100nF +/-20% 25V 0805)
C9  value 100nF  [CAPC0805(2012)145_L]  (hidden comment: Capacitor 100nF +/-20% 25V 0805)
C10  value 100nF  [CAPC0805(2012)145_L]  (hidden comment: Capacitor 100nF +/-20% 25V 0805)
U1  MK22FN512VLH12  [LQFP-64_10X10X1.6_NXP]  (part B of 2)

### Nets
3V3: C4.2 C5.2 C6.2 C7.2 C8.2 C9.2 U1.3(VDD) U1.13(VDDA) U1.14(VREFH) U1.30(VDD) U1.48(VDD)
GND: C4.1 C5.1 C6.1 C7.1 C8.1 C9.1 C10.1 U1.4(VSS) U1.15(VREFL) U1.16(VSSA) U1.31(VSS) U1.47(VSS)  [project net Ground]
NetC10_2: C10.2 U1.17(VREF_OUT/CMP1_IN5/CMP0_IN5/ADC1_SE18)

Not connected (* = marked no-connect by the designer): U1 21(VBAT)*

### Notes on the sheet
- Decoupling Capacitors
- Microcontroller Power Pins
- Place capacitors as close to pins as possible.
- Date:
- Sheet
- of
- Time:
- Revision:
- Drawn by:
- File:
- (in symbol MK22FN512VLH12, part B) 2 of 2

### Library data of the parts
C4-C6 = CMP-001-00079-2: as C12 on sheet Power_and_Control; Pins: 2; Max Operating Temperature: 85°C; Mounting Technology: SMT; Case/Package: 0805; Voltage Rating: 25V; Min Operating Temperature: -55°C
C7-C10 = CMP-001-00079-2: as C16 on sheet BarometricPressureSensor; Pins: 2; Max Operating Temperature: 85°C; Mounting Technology: SMT; Case/Package: 0805; Voltage Rating: 25V; Min Operating Temperature: -55°C
U1 = MK22FN512VLH12: as U1 on sheet Microcontroller_IO; Copyright: Copyright (C) 2016 Accelerated Designs. All rights reserved; Package: LQFP; Manufacturer_Part_Number: MK22FN512VLH12; RefDes: RefDes; Type: DEV

## Nets that join several sheets
3V3: Master (P13.2), Microcontroller_IO (P1.1 R1.2), Power_and_Control (C13.2 R2.2 R5.2 U2.2), BarometricPressureSensor (8 pins), Bluetooth (6 pins), Microcontroller_Power (11 pins)
3V3_USER: Master (P12.2 P12.4 P13.4), Power_and_Control (C15.2 R6.2 U3.2)
5V: Master (P12.1 P12.3 P13.1), Microcontroller_IO (U1.8), Power_and_Control (9 pins), BNO085_IMU (P6.1 R16.2), Servo X+ (P5_Servo_X+.2 R15_Servo_X+.2), Servo X- (P5_Servo_X-.2 R15_Servo_X-.2), Servo Y+ (P5_Servo_Y+.2 R15_Servo_Y+.2), Servo Y- (P5_Servo_Y-.2 R15_Servo_Y-.2)
Ground: Master (9 pins), Microcontroller_IO (8 pins), Power_and_Control (18 pins), USB (9 pins), BarometricPressureSensor (5 pins), Bluetooth (8 pins), BNO085_IMU (LED10.1 P6.3), ElectronicSpeedController (LED8.1 P4.1), Servo X+ (LED9_Servo_X+.1 P5_Servo_X+.1), Servo X- (LED9_Servo_X-.1 P5_Servo_X-.1), Servo Y+ (LED9_Servo_Y+.1 P5_Servo_Y+.1), Servo Y- (LED9_Servo_Y-.1 P5_Servo_Y-.1), Microcontroller_Power (12 pins)
5V_OUT: Power_and_Control (D2.2), USB (L1.1)
BT_IN: Microcontroller_IO (U1.40), Bluetooth (P3.3 U5.5)
BT_OUT: Microcontroller_IO (U1.39), Bluetooth (P3.4 U5.4)
DM: Microcontroller_IO (U1.6), USB (R20.1)
DP: Microcontroller_IO (U1.5), USB (R17.1)
ESC: Microcontroller_IO (U1.50), ElectronicSpeedController (P4.3)
ESC_5V: Power_and_Control (D1.2), ElectronicSpeedController (P4.2 R14.2)
GPIO1: Master (P11.5), Microcontroller_IO (U1.44)
GPIO2: Master (P11.7), Microcontroller_IO (U1.45)
IMU_INT: Microcontroller_IO (U1.37), BNO085_IMU (P6.6)
PWM_IN: Microcontroller_IO (U1.61), Servo X+ (P5_Servo_X+.3)
PWM_IN: Microcontroller_IO (U1.62), Servo X- (P5_Servo_X-.3)
PWM_IN: Microcontroller_IO (U1.63), Servo Y+ (P5_Servo_Y+.3)
PWM_IN: Microcontroller_IO (U1.64), Servo Y- (P5_Servo_Y-.3)
RESET: Microcontroller_IO (P1.10 U1.34), Power_and_Control (R2.1 SW1.1 SW1.2), Bluetooth (R13.1)
RX1: Master (P11.1), Microcontroller_IO (U1.2)
RX2: Master (P11.2), Microcontroller_IO (U1.59)
SCL: Microcontroller_IO (U1.35), BarometricPressureSensor (R10.1 U4.2), BNO085_IMU (P6.4)
SDA: Microcontroller_IO (U1.36), BarometricPressureSensor (R11.1 U4.4), BNO085_IMU (P6.5)
SLED1: Microcontroller_IO (U1.49), Power_and_Control (R3.2)
SLED2: Microcontroller_IO (U1.46), Power_and_Control (R7.2)
SLED3: Microcontroller_IO (U1.51), Power_and_Control (R4.2)
TX1: Master (P11.3), Microcontroller_IO (U1.1)
TX2: Master (P11.4), Microcontroller_IO (U1.60)